# EAGLE design monkeybot (EAGLE 5.12)
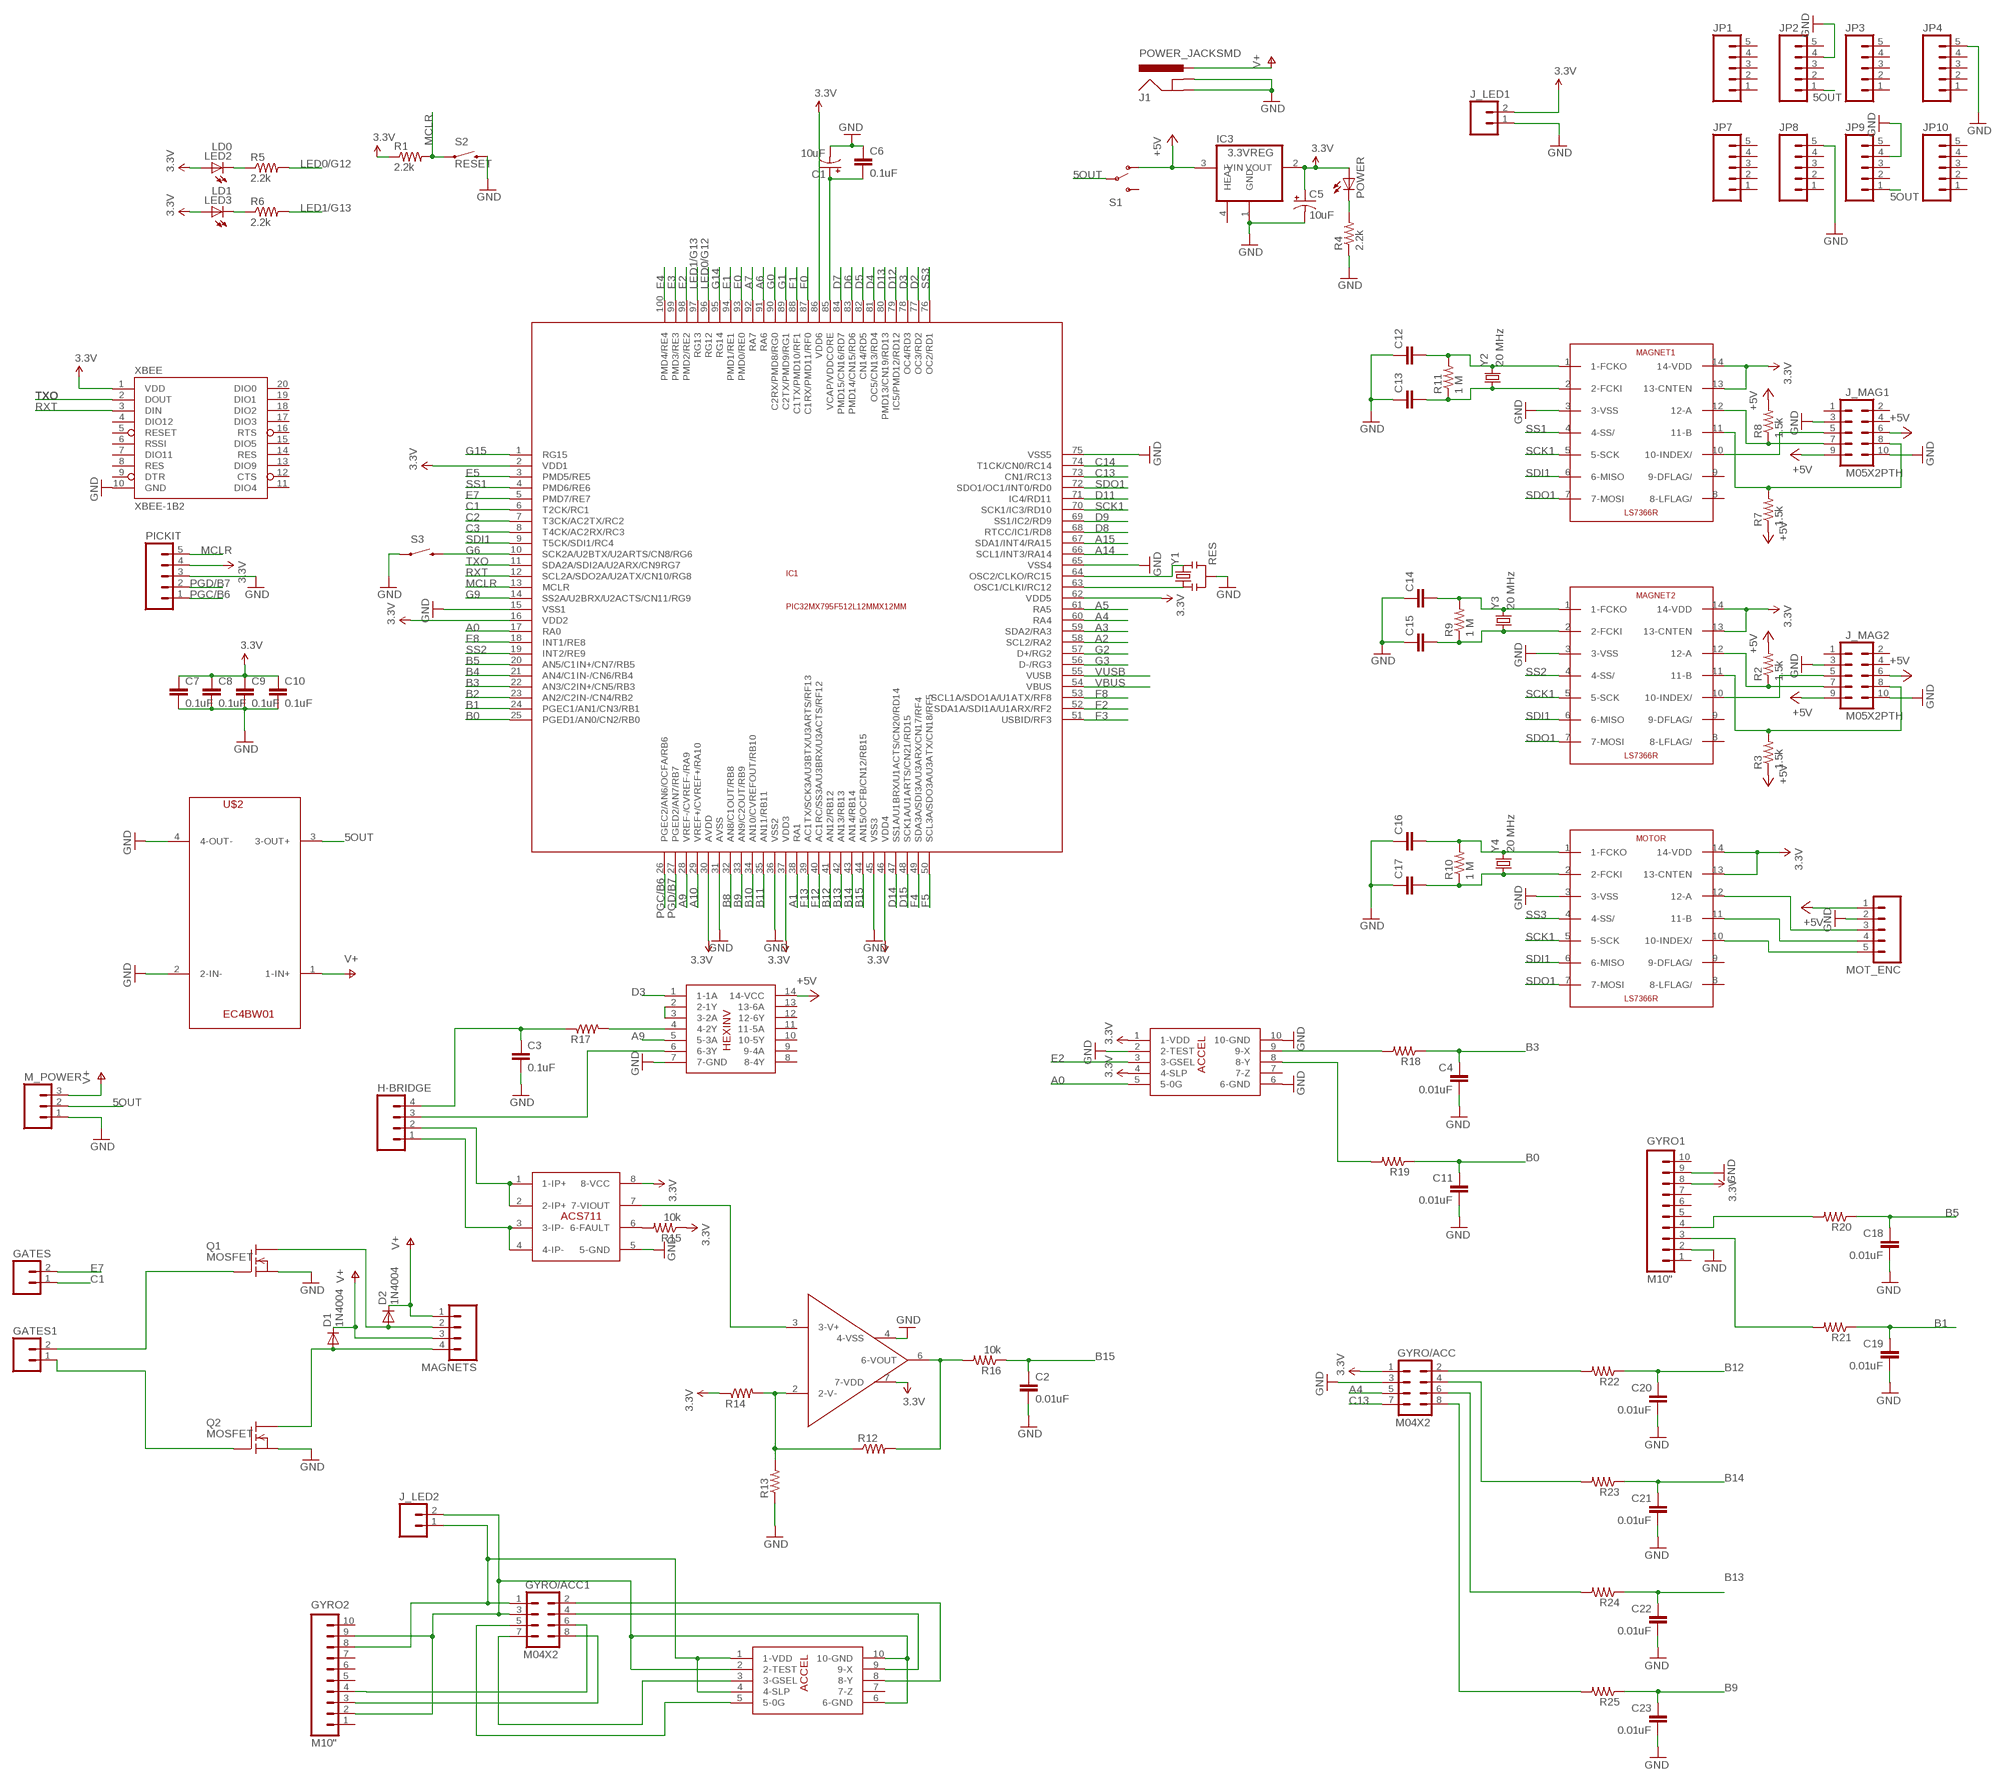
[diagram p0: schematic, sheet 1]

## Parts
C1  10uF  CAP_POL0603-POL  [0603-CAP-POL]
C2  0.01uF  CAP0603-CAP  [0603-CAP]
C3  0.1uF  CAP0603-CAP  [0603-CAP]
C4  0.01uF  CAP0603-CAP  [0603-CAP]
C5  10uF  CAP_POL0603-POL  [0603-CAP-POL]
C6  0.1uF  CAP0603-CAP  [0603-CAP]
C7  0.1uF  CAP0603-CAP  [0603-CAP]
C8  0.1uF  CAP0603-CAP  [0603-CAP]
C9  0.1uF  CAP0603-CAP  [0603-CAP]
C10  0.1uF  CAP0603-CAP  [0603-CAP]
C11  0.01uF  CAP0603-CAP  [0603-CAP]
C12  CAP0603-CAP  [0603-CAP]
C13  CAP0603-CAP  [0603-CAP]
C14  CAP0603-CAP  [0603-CAP]
C15  CAP0603-CAP  [0603-CAP]
C16  CAP0603-CAP  [0603-CAP]
C17  CAP0603-CAP  [0603-CAP]
C18  0.01uF  CAP0603-CAP  [0603-CAP]
C19  0.01uF  CAP0603-CAP  [0603-CAP]
C20  0.01uF  CAP0603-CAP  [0603-CAP]
C21  0.01uF  CAP0603-CAP  [0603-CAP]
C22  0.01uF  CAP0603-CAP  [0603-CAP]
C23  0.01uF  CAP0603-CAP  [0603-CAP]
D1  1N4004  [DO41-10]
D2  1N4004  [DO41-10]
GATES  M02PTH  [1X02]
GATES1  M02PTH  [1X02]
GYRO1  M10"  [1X10]
GYRO2  M10"  [1X10]
GYRO/ACC  M04X2  [2X4]
GYRO/ACC1  M04X2  [2X4]
H-BRIDGE  M04PTH  [1X04]
IC1  PIC32MX795F512L12MMX12MM  [TQFP-100-12X12MM]
IC3  3.3VREG  REG1117  [SOT223]
J1  POWER_JACKSMD  [POWER_JACK_SMD]
J_LED1  M02PTH  [1X02]
J_LED2  M02PTH  [1X02]
J_MAG1  M05X2PTH  [AVR_ICSP]
J_MAG2  M05X2PTH  [AVR_ICSP]
JP1  M05PTH  [1X05]
JP2  M05PTH  [1X05]
JP3  M05PTH  [1X05]
JP4  M05PTH  [1X05]
JP7  M05PTH  [1X05]
JP8  M05PTH  [1X05]
JP9  M05PTH  [1X05]
JP10  M05PTH  [1X05]
LED2  LD0  LED0603  [LED-0603]
LED3  LD1  LED0603  [LED-0603]
M_POWER  M03PTH  [1X03]
MAGNET1  LS7366R  [SO14]
MAGNET2  LS7366R  [SO14]
MAGNETS  M04PTH  [1X04]
MOT_ENC  M05PTH  [1X05]
MOTOR  LS7366R  [SO14]
PICKIT  M05PTH  [1X05]
POWER  LED0603  [LED-0603]
Q1  MOSFET  [DPACK]
Q2  MOSFET  [DPACK]
R1  2.2k  R-US_R0603  [R0603]
R2  1.5k  R-US_R0603  [R0603]
R3  1.5k  R-US_R0603  [R0603]
R4  2.2k  R-US_R0603  [R0603]
R5  2.2k  R-US_R0603  [R0603]
R6  2.2k  R-US_R0603  [R0603]
R7  1.5k  R-US_R0603  [R0603]
R8  1.5k  R-US_R0603  [R0603]
R9  1 M  R-US_R0603  [R0603]
R10  1 M  R-US_R0603  [R0603]
R11  1 M  R-US_R0603  [R0603]
R12  R-US_0204/7  [0204/7]
R13  R-US_0204/7  [0204/7]
R14  R-US_0204/7  [0204/7]
R15  10k  R-US_R0603  [R0603]
R16  10k  R-US_R0603  [R0603]
R17  R-US_0204/7  [0204/7]
R18  R-US_0204/7  [0204/7]
R19  R-US_0204/7  [0204/7]
R20  R-US_0204/7  [0204/7]
R21  R-US_0204/7  [0204/7]
R22  R-US_0204/7  [0204/7]
R23  R-US_0204/7  [0204/7]
R24  R-US_0204/7  [0204/7]
R25  R-US_0204/7  [0204/7]
S1  SWITCH-SPSTSMD  [AYZ0202]
S2  RESET  SWITCH-MOMENTARY-2-SMD-1101NE  [TACTILE-SWITCH-1101NE]
S3  SWITCH-MOMENTARY-2-SMD-1101NE  [TACTILE-SWITCH-1101NE]
U$1  ACCEL  [ACCEL]
U$2  EC4BW01  [EC4BW01]
U$3  74HC04  [74HC04]
U$6  ACS711  [ACS711]
U$7  MCP616  [MCP616]
U$8  ACCEL  [ACCEL]
XBEE  XBEE-1B2  [XBEE-SILK]
Y1  RES  RESONATORSMD  [RESONATOR-SMD]
Y2  20 MHz  CRYSTALHC49US  [HC49US]
Y3  20 MHz  CRYSTALHC49US  [HC49US]
Y4  20 MHz  CRYSTALHC49US  [HC49US]

## Nets
3.3V: C5.1(+) C7.1 C8.1 C9.1 C10.1 GYRO1.8 GYRO/ACC.1 IC1.2(VDD1) IC1.16(VDD2) IC1.30(AVDD) IC1.37(VDD3) IC1.46(VDD4) IC1.62(VDD5) IC1.86(VDD6) IC3.2(VOUT) J_LED1.2 LED2.A LED3.A MAGNET1.13(13-CNTEN) MAGNET1.14(14-VDD) MAGNET2.13(13-CNTEN) MAGNET2.14(14-VDD) MOTOR.13(13-CNTEN) MOTOR.14(14-VDD) PICKIT.4 POWER.A R1.1 R14.1 R15.1 U$6.8(8-VCC) U$7.7(7-VDD) U$8.1(1-VDD) U$8.4(4-SLP) XBEE.1(VDD)
5OUT: JP2.1 JP9.1 M_POWER.2 S1.2(P) U$2.3(3-OUT+)
+5V: IC3.3(VIN) J_MAG1.6 J_MAG1.9 J_MAG2.6 J_MAG2.9 MOT_ENC.1 R2.2 R3.1 R7.1 R8.2 S1.1(O) U$3.14(14-VCC)
A0: IC1.17(RA0) U$8.5(5-0G)
A1: IC1.38(RA1)
A2: IC1.58(SCL2/RA2)
A3: IC1.59(SDA2/RA3)
A4: GYRO/ACC.5 IC1.60(RA4)
A5: IC1.61(RA5)
A6: IC1.91(RA6)
A7: IC1.92(RA7)
A9: IC1.28(VREF-/CVREF-/RA9) U$3.5(5-3A)
A10: IC1.29(VREF+/CVREF+/RA10)
A14: IC1.66(SCL1/INT3/RA14)
A15: IC1.67(SDA1/INT4/RA15)
B0: C11.1 IC1.25(PGED1/AN0/CN2/RB0) R19.1
B1: C19.1 IC1.24(PGEC1/AN1/CN3/RB1) R21.1
B2: IC1.23(AN2/C2IN-/CN4/RB2)
B3: C4.1 IC1.22(AN3/C2IN+/CN5/RB3) R18.1
B4: IC1.21(AN4/C1IN-/CN6/RB4)
B5: C18.1 IC1.20(AN5/C1IN+/CN7/RB5) R20.1
B8: IC1.32(AN8/C1OUT/RB8)
B9: C23.1 IC1.33(AN9/C2OUT/RB9) R25.1
B10: IC1.34(AN10/CVREFOUT/RB10)
B11: IC1.35(AN11/RB11)
B12: C20.1 IC1.41(AN12/RB12) R22.1
B13: C22.1 IC1.42(AN13/RB13) R24.1
B14: C21.1 IC1.43(AN14/RB14) R23.1
B15: C2.1 IC1.44(AN15/OCFB/CN12/RB15) R16.1
C1: GATES.1 IC1.6(T2CK/RC1)
C2: IC1.7(T3CK/AC2TX/RC2)
C3: IC1.8(T4CK/AC2RX/RC3)
C12: IC1.63(OSC1/CLKI/RC12) Y1.1
C13: GYRO/ACC.7 IC1.73(CN1/RC13)
C14: IC1.74(T1CK/CN0/RC14)
C15: IC1.64(OSC2/CLKO/RC15) Y1.3
D2: IC1.77(OC3/RD2)
D3: IC1.78(OC4/RD3) U$3.1(1-1A)
D4: IC1.81(OC5/CN13/RD4)
D5: IC1.82(CN14/RD5)
D6: IC1.83(PMD14/CN15/RD6)
D7: IC1.84(PMD15/CN16/RD7)
D8: IC1.68(RTCC/IC1/RD8)
D9: IC1.69(SS1/IC2/RD9)
D11: IC1.71(IC4/RD11)
D12: IC1.79(IC5/PMD12/RD12)
D13: IC1.80(PMD13/CN19/RD13)
D14: IC1.47(SS1A/U1BRX/U1ACTS/CN20/RD14)
D15: IC1.48(SCK1A/U1ARTS/CN21/RD15)
E0: IC1.93(PMD0/RE0)
E1: IC1.94(PMD1/RE1)
E2: IC1.98(PMD2/RE2) U$8.3(3-GSEL)
E3: IC1.99(PMD3/RE3)
E4: IC1.100(PMD4/RE4)
E5: IC1.3(PMD5/RE5)
E7: GATES.2 IC1.5(PMD7/RE7)
E8: IC1.18(INT1/RE8)
F0: IC1.87(C1RX/PMD11/RF0)
F1: IC1.88(C1TX/PMD10/RF1)
F2: IC1.52(SDA1A/SDI1A/U1ARX/RF2)
F3: IC1.51(USBID/RF3)
F4: IC1.49(SDA3A/SDI3A/U3ARX/CN17/RF4)
F5: IC1.50(SCL3A/SDO3A/U3ATX/CN18/RF5)
F8: IC1.53(SCL1A/SDO1A/U1ATX/RF8)
F12: IC1.40(AC1RC/SS3A/U3BRX/U3ACTS/RF12)
F13: IC1.39(AC1TX/SCK3A/U3BTX/U3ARTS/RF13)
G0: IC1.90(C2RX/PMD8/RG0)
G1: IC1.89(C2TX/PMD9/RG1)
G2: IC1.57(D+/RG2)
G3: IC1.56(D-/RG3)
G6: IC1.10(SCK2A/U2BTX/U2ARTS/CN8/RG6) S3.P$2
G9: IC1.14(SS2A/U2BRX/U2ACTS/CN11/RG9)
G14: IC1.95(RG14)
G15: IC1.1(RG15)
GND: C1.2(-) C2.2 C3.2 C4.2 C5.2(-) C6.1 C7.2 C8.2 C9.2 C10.2 C11.2 C12.1 C13.1 C14.1 C15.1 C16.1 C17.1 C18.2 C19.2 C20.2 C21.2 C22.2 C23.2 GYRO1.2 GYRO1.9 GYRO/ACC.3 IC1.15(VSS1) IC1.31(AVSS) IC1.36(VSS2) IC1.45(VSS3) IC1.65(VSS4) IC1.75(VSS5) IC3.1(GND) J1.GND(GNDBREAK) J1.P$4(GND) J_LED1.1 J_MAG1.3 J_MAG1.10 J_MAG2.3 J_MAG2.10 JP2.4 JP4.5 JP8.5 JP9.4 M_POWER.1 MAGNET1.3(3-VSS) MAGNET2.3(3-VSS) MOT_ENC.2 MOTOR.3(3-VSS) PICKIT.3 Q1.3(S) Q2.3(S) R4.1 R13.1 S2.P$2 S3.P$1 U$2.2(2-IN-) U$2.4(4-OUT-) U$3.7(7-GND) U$6.5(5-GND) U$7.4(4-VSS) U$8.2(2-TEST) U$8.6(6-GND) U$8.10(10-GND) XBEE.10(GND) Y1.2
LED0/G12: IC1.96(RG12) R5.2
LED1/G13: IC1.97(RG13) R6.2
MCLR: IC1.13(MCLR) PICKIT.5 R1.2 S2.P$1
N$2: C12.2 MAGNET1.1(1-FCKO) R11.2 Y2.2
N$3: C1.1(+) C6.2 IC1.85(VCAP/VDDCORE)
N$4: POWER.C R4.2
N$5: LED2.C R5.1
N$6: J_MAG2.7 MAGNET2.12(12-A) R2.1
N$7: LED3.C R6.1
N$8: J_MAG1.7 MAGNET1.12(12-A) R8.1
N$9: GYRO1.4 R20.2
N$10: J_MAG2.8 MAGNET2.11(11-B) R3.2
N$11: J_MAG1.8 MAGNET1.11(11-B) R7.2
N$12: J_MAG1.5 MAGNET1.10(10-INDEX/)
N$13: J_MAG2.5 MAGNET2.10(10-INDEX/)
N$14: GYRO/ACC.2 R22.2
N$15: C13.2 MAGNET1.2(2-FCKI) R11.1 Y2.1
N$16: C14.2 MAGNET2.1(1-FCKO) R9.2 Y3.2
N$17: C15.2 MAGNET2.2(2-FCKI) R9.1 Y3.1
N$18: C16.2 MOTOR.1(1-FCKO) R10.2 Y4.2
N$19: C17.2 MOTOR.2(2-FCKI) R10.1 Y4.1
N$20: MOT_ENC.3 MOTOR.12(12-A)
N$21: MOT_ENC.4 MOTOR.11(11-B)
N$22: MOT_ENC.5 MOTOR.10(10-INDEX/)
N$23: R15.2 U$6.6(6-FAULT)
N$24: U$6.7(7-VIOUT) U$7.3(3-V+)
N$25: R12.1 R13.2 R14.2 U$7.2(2-V-)
N$26: R12.2 R16.2 U$7.6(6-VOUT)
N$27: U$3.2(2-1Y) U$3.3(3-2A)
N$28: R17.2 U$3.4(4-2Y)
N$29: H-BRIDGE.2 U$6.1(1-IP+) U$6.2(2-IP+)
N$30: H-BRIDGE.1 U$6.3(3-IP-) U$6.4(4-IP-)
N$31: H-BRIDGE.3 U$3.6(6-3Y)
N$32: GATES1.2 Q1.1(G)
N$33: GATES1.1 Q2.1(G)
N$34: GYRO1.3 R21.2
N$35: R19.2 U$8.8(8-Y)
N$36: R18.2 U$8.9(9-X)
N$38: GYRO/ACC.4 R23.2
N$43: GYRO/ACC.6 R24.2
N$44: GYRO/ACC.8 R25.2
N$45: D2.A MAGNETS.2 Q1.4(D)
N$46: D1.A MAGNETS.4 Q2.4(D)
N$47: GYRO2.8 GYRO/ACC1.1 J_LED2.1 U$1.1(1-VDD) U$1.4(4-SLP)
N$48: GYRO2.2 GYRO2.9 GYRO/ACC1.3 J_LED2.2 U$1.2(2-TEST) U$1.6(6-GND) U$1.10(10-GND)
N$49: GYRO2.3 GYRO/ACC1.8
N$50: GYRO2.4 GYRO/ACC1.6
N$51: GYRO/ACC1.7 U$1.3(3-GSEL)
N$52: GYRO/ACC1.4 U$1.9(9-X)
N$53: GYRO/ACC1.5 U$1.5(5-0G)
N$54: GYRO/ACC1.2 U$1.8(8-Y)
N$115: C3.1 H-BRIDGE.4 R17.1
PGC/B6: IC1.26(PGEC2/AN6/OCFA/RB6) PICKIT.1
PGD/B7: IC1.27(PGED2/AN7/RB7) PICKIT.2
RXT: IC1.12(SCL2A/SDO2A/U2ATX/CN10/RG8) XBEE.3(DIN)
SCK1: IC1.70(SCK1/IC3/RD10) MAGNET1.5(5-SCK) MAGNET2.5(5-SCK) MOTOR.5(5-SCK)
SDI1: IC1.9(T5CK/SDI1/RC4) MAGNET1.6(6-MISO) MAGNET2.6(6-MISO) MOTOR.6(6-MISO)
SDO1: IC1.72(SDO1/OC1/INT0/RD0) MAGNET1.7(7-MOSI) MAGNET2.7(7-MOSI) MOTOR.7(7-MOSI)
SS1: IC1.4(PMD6/RE6) MAGNET1.4(4-SS/)
SS2: IC1.19(INT2/RE9) MAGNET2.4(4-SS/)
SS3: IC1.76(OC2/RD1) MOTOR.4(4-SS/)
TXO: IC1.11(SDA2A/SDI2A/U2ARX/CN9RG7) XBEE.2(DOUT)
V+: D1.C D2.C J1.VIN0(PWR) M_POWER.3 MAGNETS.1 MAGNETS.3 U$2.1(1-IN+)
VBUS: IC1.54(VBUS)
VUSB: IC1.55(VUSB)
Unconnected: GYRO1.1 GYRO1.5 GYRO1.6 GYRO1.7 GYRO1.10 GYRO2.1 GYRO2.5 GYRO2.6 GYRO2.7 GYRO2.10 IC3.4(HEAT) J_MAG1.1 J_MAG1.2 J_MAG1.4 J_MAG2.1 J_MAG2.2 J_MAG2.4 JP1.1 JP1.2 JP1.3 JP1.4 JP1.5 JP2.2 JP2.3 JP2.5 JP3.1 JP3.2 JP3.3 JP3.4 JP3.5 JP4.1 JP4.2 JP4.3 JP4.4 JP7.1 JP7.2 JP7.3 JP7.4 JP7.5 JP8.1 JP8.2 JP8.3 JP8.4 JP9.2 JP9.3 JP9.5 JP10.1 JP10.2 JP10.3 JP10.4 JP10.5 MAGNET1.8(8-LFLAG/) MAGNET1.9(9-DFLAG/) MAGNET2.8(8-LFLAG/) MAGNET2.9(9-DFLAG/) MOTOR.8(8-LFLAG/) MOTOR.9(9-DFLAG/) S1.3(S) U$1.7(7-Z) U$3.8(8-4Y) U$3.9(9-4A) U$3.10(10-5Y) U$3.11(11-5A) U$3.12(12-6Y) U$3.13(13-6A) U$8.7(7-Z) XBEE.4(DIO12) XBEE.5(RESET) XBEE.6(RSSI) XBEE.7(DIO11) XBEE.8(RES) XBEE.9(DTR) XBEE.11(DIO4) XBEE.12(CTS) XBEE.13(DIO9) XBEE.14(RES) XBEE.15(DIO5) XBEE.16(RTS) XBEE.17(DIO3) XBEE.18(DIO2) XBEE.19(DIO1) XBEE.20(DIO0)

## Library data of the parts
C1 C5 = nick_nu32_pic32mx795_v1:CAP_POL: Capacitor Polarized These are standard SMD and PTH capacitors. Normally 10uF, 47uF, and 100uF in electrolytic and tantalum varieties. Always verify the external diameter of the through hole cap, it varies with capacity, voltage, and manufacturer. The EIA devices should be standard.
C2-C4 C6-C23 = nick_nu32_pic32mx795_v1:CAP: Capacitor Standard 0603 ceramic capacitor, and 0.1" leaded capacitor.
D1 D2 = diode:1N4004: DIODE general purpose rectifier, 1 A
GATES GATES1 J_LED1 J_LED2 = SparkFun:M02: Header 2 Standard 2-pin 0.1" header. Use with straight break away headers (SKU : PRT-00116), right angle break away headers (PRT-00553), swiss pins (PRT-00743), machine pins (PRT-00117), and female headers (PRT-00115). Molex polarized connector foot print use with SKU : PRT-08233 with associated crimp pins and housings.
GYRO1 GYRO2 = SparkFun:M10: Header 10 Standard 10-pin 0.1" header. Use with straight break away headers (SKU : PRT-00116), right angle break away headers (PRT-00553), swiss pins (PRT-00743), machine pins (PRT-00117), and female headers (PRT-00115).
GYRO/ACC GYRO/ACC1 = SparkFun:M04X2
H-BRIDGE MAGNETS = SparkFun:M04: Header 4 Standard 4-pin 0.1" header. Use with straight break away headers (SKU : PRT-00116), right angle break away headers (PRT-00553), swiss pins (PRT-00743), machine pins (PRT-00117), and female headers (PRT-00115). Molex polarized connector foot print use with SKU : PRT-08231 with associated crimp pins and housings. 1MM SMD Version SKU: PRT-10208
IC1 = nick_nu32_pic32mx795_v1:PIC32MX795F512L
IC3 = nick_nu32_pic32mx795_v1:REG1117: 800mA and 1A Low Dropout (LDO) Positive Regulator 1.8V, 2.5V, 2.85V, 3.3V, 5V, and Adj
J1 = nick_nu32_pic32mx795_v1:POWER_JACK: Power Jack This is the standard 5.5mm barrel jack for power. The PTH is the most common, proven, reliable, footprint. All others are experimental. The Slot footprint only works if the mill layer is transmitted to the PCB fab house so be warned. Spark Fun Electronics SKU : PRT-00119. Mating wall wart : TOL-00298 (and others)
J_MAG1 J_MAG2 = andy-monkeybot:M05X2: Header 5x2 Standard 10-pin dual row 0.1" header. Commonly used with AVR-ISP. Use with Spark Fun Electronics SKU: PRT-00778
JP1-JP4 JP7-JP10 PICKIT = monkeybot:M05: Header 5 Standard 5-pin 0.1" header. Use with straight break away headers (SKU : PRT-00116), right angle break away headers (PRT-00553), swiss pins (PRT-00743), machine pins (PRT-00117), and female headers (PRT-00115). Molex polarized connector foot print use with SKU : PRT-08230 with associated crimp pins and housings.
LED2 LED3 POWER = nick_nu32_pic32mx795_v1:LED: LEDs Standard schematic elements and footprints for 5mm, 3mm, 1206, and 0603 sized LEDs. 5mm - Spark Fun Electronics SKU : COM-00529 (and others)
M_POWER = SparkFun:M03: Header 3 Standard 3-pin 0.1" header. Use with straight break away headers (SKU : PRT-00116), right angle break away headers (PRT-00553), swiss pins (PRT-00743), machine pins (PRT-00117), and female headers (PRT-00115). Molex polarized connector foot print use with SKU : PRT-08232 with associated crimp pins and housings.
MAGNET1 MAGNET2 MOTOR = andy-monkeybot:LS7366R
MOT_ENC = andy-monkeybot:M05: Header 5 Standard 5-pin 0.1" header. Use with straight break away headers (SKU : PRT-00116), right angle break away headers (PRT-00553), swiss pins (PRT-00743), machine pins (PRT-00117), and female headers (PRT-00115). Molex polarized connector foot print use with SKU : PRT-08230 with associated crimp pins and housings.
Q1 Q2 = monkeybot:MOSFET: N-Channel Enhancement MOSFET 200V; 1.5A; 1,6Ohm
R1 R4-R6 R15 R16 = nick_nu32_pic32mx795_v1:R-US_: RESISTOR, American symbol
R2 R3 R7 R8 = andy-monkeybot:R-US_: RESISTOR, American symbol
R9-R14 R17-R25 = monkeybot:R-US_: RESISTOR, American symbol
S1 = nick_nu32_pic32mx795_v1:SWITCH-SPST: SPST Switch Simple slide switch. Spark Fun Electronics SKU : COM-00102
S2 S3 = nick_nu32_pic32mx795_v1:SWITCH-MOMENTARY-2
U$1 U$8 = monkeybot:ACCEL
U$2 = monkeybot:EC4BW01
U$3 = monkeybot:74HC04
U$6 = monkeybot:ACS711
U$7 = monkeybot:MCP616
XBEE = SparkFun:XBEE-1
Y1 = nick_nu32_pic32mx795_v1:RESONATOR: Resonator Small SMD resonator. This is the itty bitty 10/20MHz resonators with built in caps. CSTCE10M0G55 and CSTCE20M0V53. Footprint has been reviewed closely but hasn't been tested yet.
Y2-Y4 = andy-monkeybot:CRYSTAL: Crystals Various standard crystals. Proven footprints. Spark Fun Electronics SKU : COM-00534

## Board
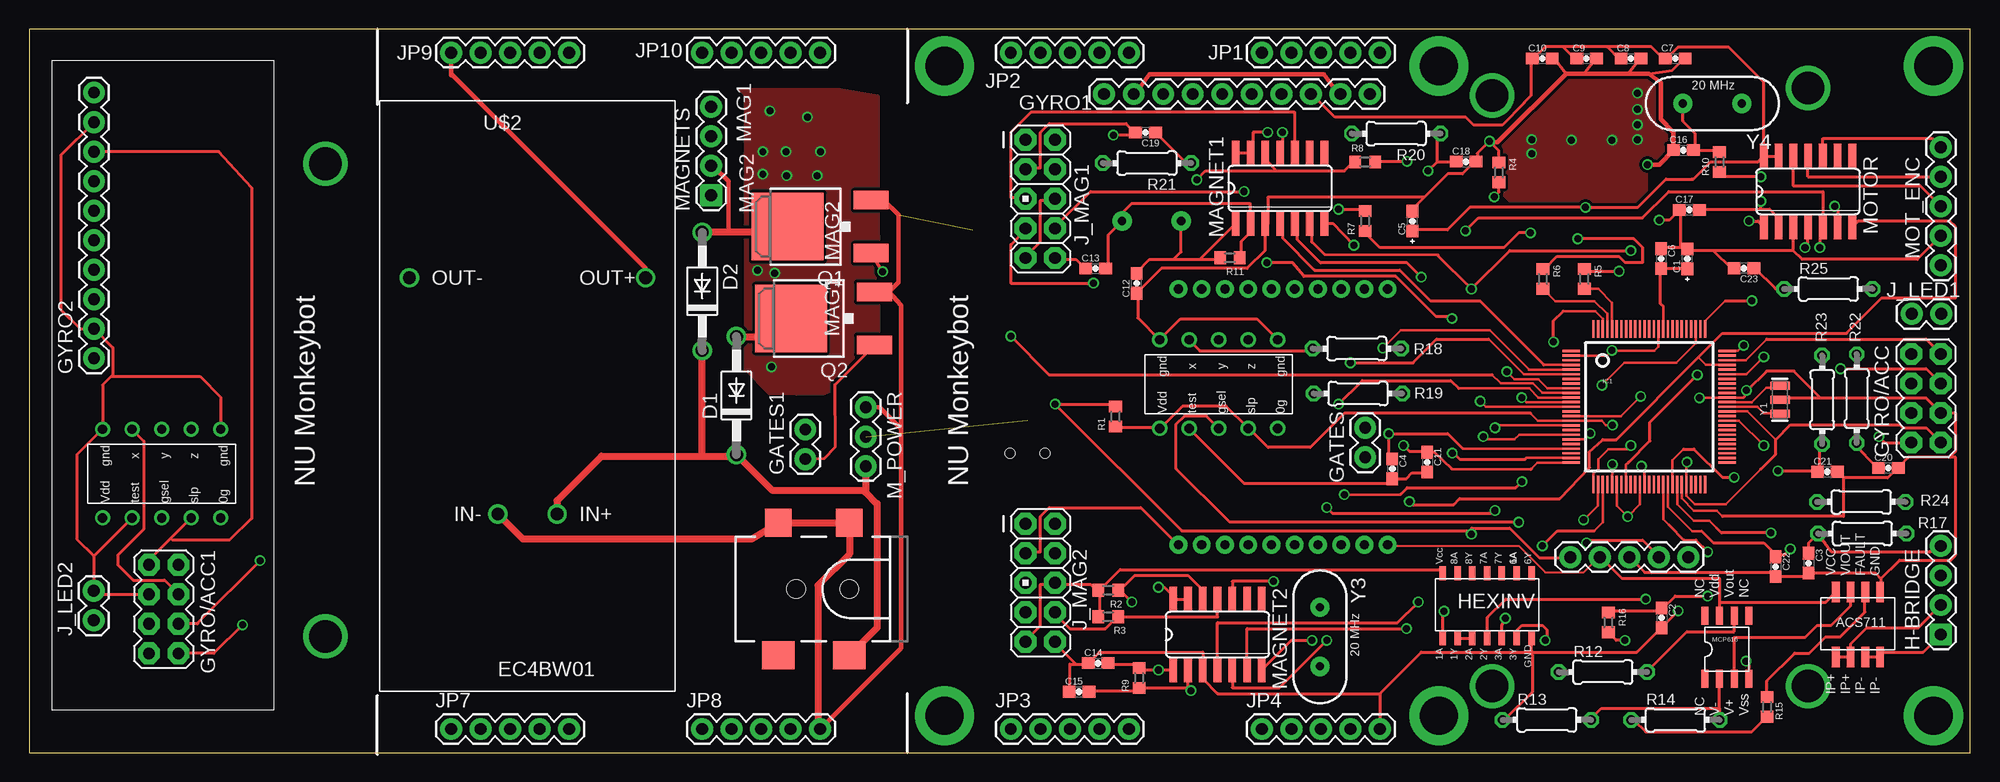
[diagram p1: board, top side]
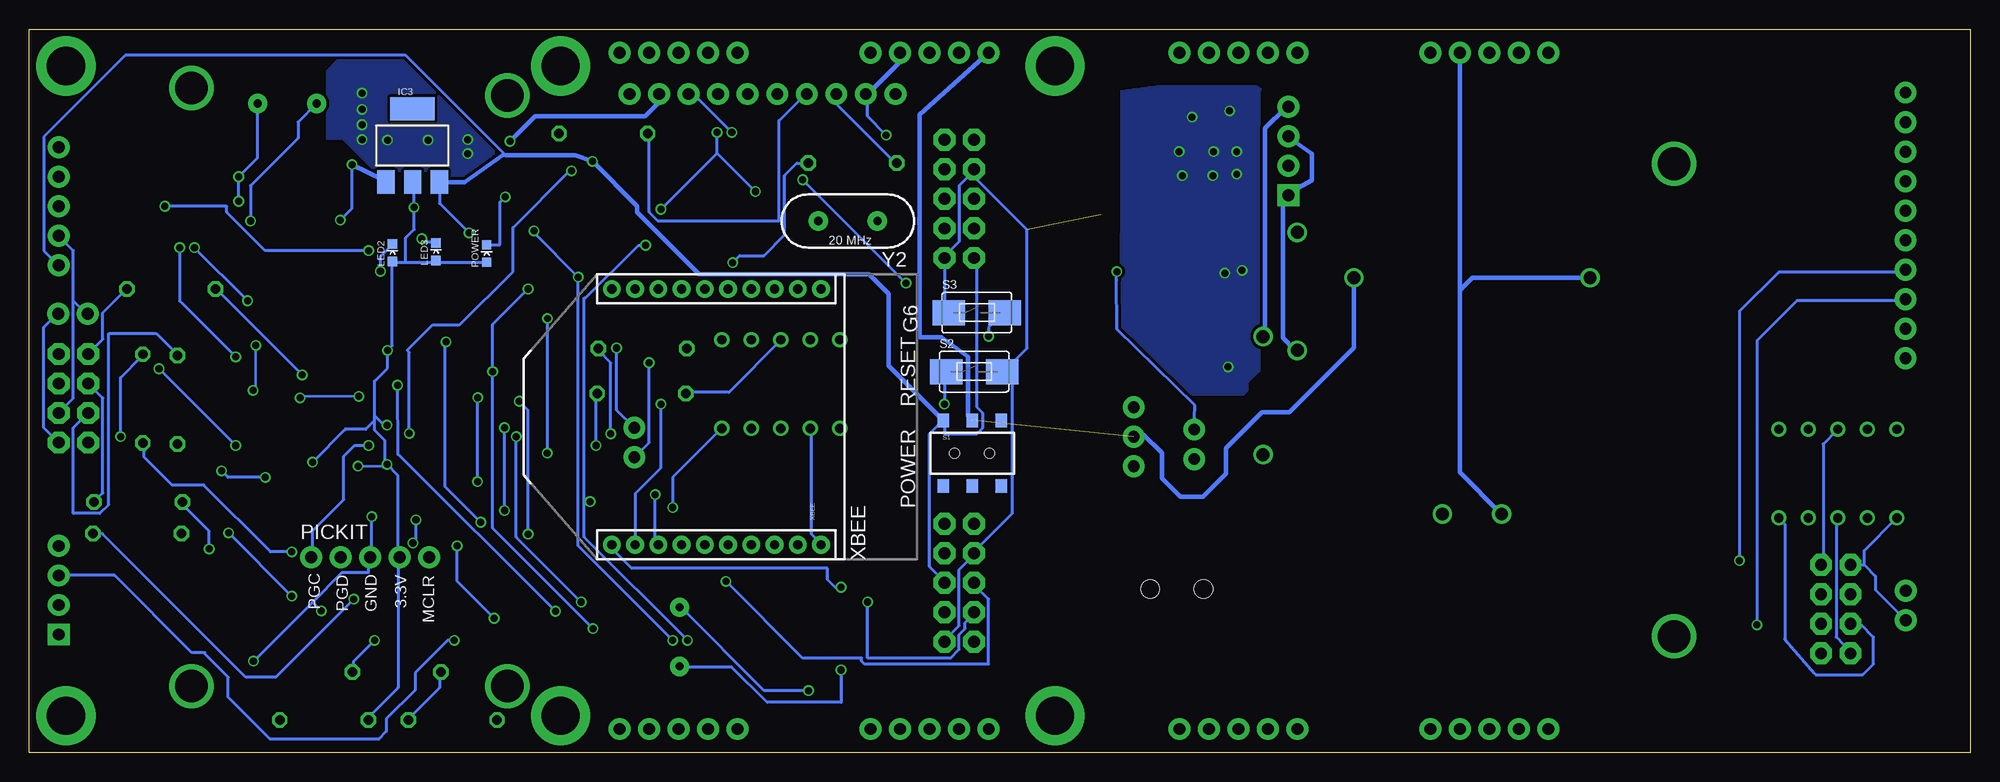
[diagram p2: board, bottom side, seen from below]

Size 167 x 62.23 mm. Coordinates in mm from the lower left corner, seen from the top.
Outline: 167,0 167,62.23 0,62.23 0,0 167,0
Copper layers (1*16): Top 0.035mm / dielectric 1.5mm / Bottom 0.035mm
Design rules "Fusion_eagle_rule_v1.1": minimum track width 6mil, minimum drill 12mil, track to track 6mil, track to pad 6mil, pad to pad 6mil, via to via 6mil, smd to smd 0mil, copper to edge 10mil, drill to drill 10mil, minimum pad ring 10mil, minimum via ring 6mil, stop-mask expansion 2mil, vias tented up to drill 100mil, thermal gap 10mil

### Footprints (pad centres in the part's own frame; a part is rotated, then mirrored left to right if it is on the bottom)
0603-CAP-POL = smd 1.1 x 1: 1 -0.85,0; 2 0.85,0
0603-CAP = smd 1.1 x 1: 1 -0.85,0; 2 0.85,0
DO41-10 = drill 1.118 round: A 5.08,0; C -5.08,0
1X02 = drill 1.016 pad 1.88 round: 1 0,0; 2 2.54,0
1X10 = drill 1.016 pad 1.88 round: 1 0,0; 2 2.54,0; 3 5.08,0; 4 7.62,0; 5 10.16,0; 6 12.7,0; 7 15.24,0; 8 17.78,0; 9 20.32,0; 10 22.86,0
2X4 = drill 1.016 pad 1.88 octagon: 1 -3.81,-1.27; 2 -3.81,1.27; 3 -1.27,-1.27; 4 -1.27,1.27; 5 1.27,-1.27; 6 1.27,1.27; 7 3.81,-1.27; 8 3.81,1.27
1X04 = drill 1.016 pad 1.88 square: 1 0,0 | drill 1.016 pad 1.88 round: 2 2.54,0; 3 5.08,0; 4 7.62,0
TQFP-100-12X12MM = smd 1.5 x 0.2: 1 -6.7,4.8; 2 -6.7,4.4; 3 -6.7,4; 4 -6.7,3.6; 5 -6.7,3.2; 6 -6.7,2.8; 7 -6.7,2.4; 8 -6.7,2; 9 -6.7,1.6; 10 -6.7,1.2; 11 -6.7,0.8; 12 -6.7,0.4; 13 -6.7,0; 14 -6.7,-0.4; 15 -6.7,-0.8; 16 -6.7,-1.2; 17 -6.7,-1.6; 18 -6.7,-2; 19 -6.7,-2.4; 20 -6.7,-2.8; 21 -6.7,-3.2; 22 -6.7,-3.6; 23 -6.7,-4; 24 -6.7,-4.4; 25 -6.7,-4.8; 51 6.7,-4.8; 52 6.7,-4.4; 53 6.7,-4; 54 6.7,-3.6; 55 6.7,-3.2; 56 6.7,-2.8; 57 6.7,-2.4; 58 6.7,-2; 59 6.7,-1.6; 60 6.7,-1.2; 61 6.7,-0.8; 62 6.7,-0.4; 63 6.7,0; 64 6.7,0.4; 65 6.7,0.8; 66 6.7,1.2; 67 6.7,1.6; 68 6.7,2; 69 6.7,2.4; 70 6.7,2.8; 71 6.7,3.2; 72 6.7,3.6; 73 6.7,4; 74 6.7,4.4; 75 6.7,4.8 | smd 0.2 x 1.5: 26 -4.8,-6.7; 27 -4.4,-6.7; 28 -4,-6.7; 29 -3.6,-6.7; 30 -3.2,-6.7; 31 -2.8,-6.7; 32 -2.4,-6.7; 33 -2,-6.7; 34 -1.6,-6.7; 35 -1.2,-6.7; 36 -0.8,-6.7; 37 -0.4,-6.7; 38 0,-6.7; 39 0.4,-6.7; 40 0.8,-6.7; 41 1.2,-6.7; 42 1.6,-6.7; 43 2,-6.7; 44 2.4,-6.7; 45 2.8,-6.7; 46 3.2,-6.7; 47 3.6,-6.7; 48 4,-6.7; 49 4.4,-6.7; 50 4.8,-6.7; 76 4.8,6.7; 77 4.4,6.7; 78 4,6.7; 79 3.6,6.7; 80 3.2,6.7; 81 2.8,6.7; 82 2.4,6.7; 83 2,6.7; 84 1.6,6.7; 85 1.2,6.7; 86 0.8,6.7; 87 0.4,6.7; 88 0,6.7; 89 -0.4,6.7; 90 -0.8,6.7; 91 -1.2,6.7; 92 -1.6,6.7; 93 -2,6.7; 94 -2.4,6.7; 95 -2.8,6.7; 96 -3.2,6.7; 97 -3.6,6.7; 98 -4,6.7; 99 -4.4,6.7; 100 -4.8,6.7
SOT223 = smd 1.499 x 2.007: 1 -2.261,-3.15; 2 0.025,-3.15; 3 2.311,-3.15 | smd 3.81 x 2.007: 4 0,3.15
POWER_JACK_SMD = smd 2.286 x 2.4: GND 0,-5.7; P$4 6.1,-5.7 | smd 2.8 x 2.4: VIN0 0,5.7; VIN1 6.1,5.7 | hole 1.6: 0,0; 4.572,0
AVR_ICSP = drill 1.016 pad 1.88 octagon: 1 -1.27,5.08; 2 1.27,5.08; 3 -1.27,2.54; 4 1.27,2.54; 5 -1.27,0; 6 1.27,0; 7 -1.27,-2.54; 8 1.27,-2.54; 9 -1.27,-5.08; 10 1.27,-5.08
1X05 = drill 1.016 pad 1.88 round: 1 0,0; 2 2.54,0; 3 5.08,0; 4 7.62,0; 5 10.16,0
LED-0603 = smd 0.8 x 0.8: A 0,-0.75; C 0,0.75
1X03 = drill 1.016 pad 1.88 round: 1 0,0; 2 2.54,0; 3 5.08,0
SO14 = smd 0.66 x 2.032: 1 -3.81,-3.073; 2 -2.54,-3.073; 3 -1.27,-3.073; 4 0,-3.073; 5 1.27,-3.073; 6 2.54,-3.073; 7 3.81,-3.073; 8 3.81,3.073; 9 2.54,3.073; 10 1.27,3.073; 11 0,3.073; 12 -1.27,3.073; 13 -2.54,3.073; 14 -3.81,3.073
DPACK = smd 1.6 x 3: 1 -2.28,-4.8; 3 2.28,-4.8 | smd 5.8 x 6.2: 4 0,2.38
R0603 = smd 1 x 1.1: 1 -0.85,0; 2 0.85,0
0204/7 = drill 0.813 octagon: 1 -3.81,0; 2 3.81,0
AYZ0202 = smd 1 x 1.15: 1 -2.5,2.825; 2 0,2.825; 3 2.5,2.825; 4 -2.5,-2.825; 5 0,-2.825; 6 2.5,-2.825 | hole 0.85: 1.5,0; -1.5,0
TACTILE-SWITCH-1101NE = smd 2.794 x 2.159: P$1 -2.413,0; P$2 2.413,0
ACCEL = drill 0.8 round: 1 0,10.16; 2 0,7.62; 3 0,5.08; 4 0,2.54; 5 0,0; 6 7.62,0; 7 7.62,2.54; 8 7.62,5.08; 9 7.62,7.62; 10 7.62,10.16
EC4BW01 = drill 1.1 round: 1 2.54,-10.16; 2 -2.54,-10.16; 3 10.16,10.16; 4 -10.16,10.16
74HC04 = smd 0.559 x 1.194: 1 0,0; 2 1.27,0; 3 2.54,0; 4 3.81,0; 5 5.08,0; 6 6.35,0; 7 7.62,0; 8 7.62,5.588; 9 6.35,5.588; 10 5.08,5.588; 11 3.81,5.588; 12 2.54,5.588; 13 1.27,5.588; 14 0,5.588
ACS711 = smd 0.66 x 1.753: 1 0,0; 2 1.27,0; 3 2.54,0; 4 3.81,0; 5 3.81,5.588; 6 2.54,5.588; 7 1.27,5.588; 8 0,5.588
MCP616 = smd 0.61 x 1.549: 1 0,0; 2 1.27,0; 3 2.54,0; 4 3.81,0; 5 3.81,5.41; 6 2.54,5.41; 7 1.27,5.41; 8 0,5.41
XBEE-SILK = drill 0.8 pad 1.524 round: 1 -11,20; 2 -11,18; 3 -11,16; 4 -11,14; 5 -11,12; 6 -11,10; 7 -11,8; 8 -11,6; 9 -11,4; 10 -11,2; 11 11,2; 12 11,4; 13 11,6; 14 11,8; 15 11,10; 16 11,12; 17 11,14; 18 11,16; 19 11,18; 20 11,20
RESONATOR-SMD = smd 0.7 x 1.7: 1 -1.2,0; 2 0,0; 3 1.2,0
HC49US = drill 0.7 pad 1.651 round: 1 -2.54,0; 2 2.54,0

### Placement (x,y rotation side)
C1  142.65,42.47 90 top
C2  140.44,11.58 270 top
C3  153.09,16.31 270 top
C4  117.27,24.41 270 top
C5  119,45.72 90 top
C6  140.39,42.49 270 top
C7  141.61,59.69 0 top
C8  137.79,59.69 0 top
C9  133.99,59.69 0 top
C10  130.18,59.69 0 top
C11  120.27,24.99 270 top
C12  95.28,40.36 90 top
C13  91.74,41.63 0 top
C14  91.97,7.7 0 top
C15  90.32,5.23 0 top
C16  142.32,51.82 0 top
C17  142.82,46.69 0 top
C18  123.62,50.83 0 top
C19  96.04,53.34 180 top
C20  159.94,24.49 0 top
C21  154.71,24.16 0 top
C22  150.24,16 270 top
C23  147.52,41.66 180 top
D1  60.86,30.71 90 top
D2  57.91,39.67 90 top
GATES  114.94,25.4 90 top
GATES1  66.78,25.25 90 top
GYRO1  92.48,56.64 0 top
GYRO2  5.59,33.91 90 top
GYRO/ACC  163.19,30.48 90 top
GYRO/ACC1  11.58,12.34 270 top
H-BRIDGE  164.47,10.16 90 top
IC1  139.37,29.74 0 top
IC3  134.04,52.22 0 bottom
J1  70.56,14.07 180 top
J_LED1  161.95,37.74 0 top
J_LED2  5.56,11.38 90 top
J_MAG1  87,47.62 0 top
J_MAG2  87,14.61 0 top
JP1  106.05,60.2 0 top
JP2  84.45,60.2 0 top
JP3  84.45,2.03 0 top
JP4  106.05,2.03 0 top
JP7  36.3,2.03 0 top
JP8  57.89,2.03 0 top
JP9  36.3,60.2 0 top
JP10  57.89,60.2 0 top
LED2  135.74,43 0 bottom
LED3  132,43.08 0 bottom
M_POWER  71.98,29.72 270 top
MAGNET1  107.62,48.54 0 top
MAGNET2  102.23,10.16 0 top
MAGNETS  58.67,47.93 90 top
MOT_ENC  164.47,41.91 90 top
MOTOR  153.03,48.26 0 top
PICKIT  142.75,16.81 180 top
POWER  127.63,42.93 0 bottom
Q1  67.64,45.24 90 top
Q2  67.92,37.34 90 top
R1  93.45,28.91 90 top
R2  92.84,13.97 180 top
R3  92.84,11.68 0 top
R4  126.44,49.91 270 top
R5  133.78,40.74 270 top
R6  130.23,40.74 270 top
R7  114.94,45.72 90 top
R8  114.94,50.8 0 top
R9  95.5,6.43 90 top
R10  145.41,50.8 90 top
R11  103.3,42.57 180 top
R12  135.38,6.93 0 top
R13  130.56,2.82 0 top
R14  141.63,2.82 0 top
R15  149.5,3.94 90 top
R16  135.86,11.2 270 top
R17  157.71,18.85 0 top
R18  114.22,34.75 180 top
R19  114.33,30.89 180 top
R20  117.6,53.24 180 top
R21  96.16,50.7 180 top
R22  157.23,30.45 90 top
R23  154.25,30.35 90 top
R24  157.61,21.56 0 top
R25  154.79,39.88 0 top
S1  85.88,25.76 0 bottom
S2  85.7,32.77 0 bottom
S3  85.47,37.85 0 bottom
U$1  16.48,20.19 90 top
U$2  42.88,30.68 0 top
U$3  121.62,9.86 0 top
U$6  155.42,8.23 0 top
U$7  144.14,6.35 0 top
U$8  107.42,27.89 90 top
XBEE  96.88,28.88 90 bottom
Y1  150.62,30.35 90 top
Y2  96.57,45.72 180 bottom
Y3  111.05,9.96 270 top
Y4  144.81,55.83 180 top

### Tracks (layer width: path | path; a pad name or v marks a point on that pad's centre or on a via)
3.3V  (via drill 0.6, 0.61)
  Top 0.152: 93.6,27.94 R1.1 | PICKIT.4 135,16.76 133.73,15.49 130.43,15.49 128.14,17.78 116.97,17.78 XBEE.1
  Top 0.203: 129.16,29.18 129.8,28.54 IC1.16 135.29,28.54 135.66,28.17 v136.22,28.17 | v136.22,24.79 136.22,23.93 136.17,23.88 IC1.30 | IC1.2 135.72,34.14 v136.17,34.59 136.19,34.57 139.83,34.57 140.17,34.91 IC1.86 | IC1.37 138.97,24.38 v138.71,24.64 | IC1.62 147.82,29.34 150.24,26.92 | v142.62,24.99 142.57,24.94 IC1.46 142.57,22.1 143.31,21.36 145.95,21.36 148.97,24.38
  Top 0.254: MAGNET1.14 104.01,51.56 105.03,51.56 MAGNET1.13 105.28,51.82 105.28,53.34 v106.55,53.34 | 131.95,60.71 130.43,60.71 129.41,59.69 C10.1 129.18,59.55 129.18,56.49 128.6,55.91 128.6,55.85 126.72,53.98 124.28,53.98 123.6,54.66 112.34,54.66 110.36,56.64 GYRO1.8 | 131.95,60.71 132.97,59.69 C9.1 | 135.76,60.71 136.78,59.69 C8.1 | 135.76,60.71 131.95,60.71 | 135.76,60.71 139.57,60.71 140.59,59.69 C7.1 140.84,59.69 141.86,60.71 141.88,60.68 146.2,60.68 149.22,57.66 MOTOR.14 149.22,51.31 | 149.22,51.31 148.72,50.8 144.65,50.8 143.13,49.28 143.08,49.33 140.82,49.33 138.38,46.89 v133.88,46.89 123.95,46.89 122.02,44.96 119,44.96 C5.1 | 149.22,51.31 150.5,51.31 MOTOR.13 | MAGNET2.13 99.69,13.21 98.42,13.21 MAGNET2.14 98.42,13.46 97.66,14.22 v97.16,14.22 | 129.16,29.18 129.16,29.21 113.16,29.21 110.21,26.26 106.58,26.26 104.95,27.89 U$8.4 102.97,29.79 99.24,29.79 97.38,27.94 97.21,27.94 | 148.97,24.38 150.24,25.65 150.24,26.92 151.51,28.19 160.91,28.19 161.16,27.94 163.19,27.94 GYRO/ACC.1 | 145.41,12.95 U$7.7 | R14.1 138.05,2.79 139.06,1.78 148.19,1.78 R15.1 | 145.41,12.95 145.41,14.99 137.03,14.99 135.25,16.76 PICKIT.4 | 145.41,12.95 154.56,12.95 U$6.8 | 97.21,27.94 93.6,27.94 | 97.21,27.94 U$8.1
  Top 0.406: R15.1 149.48,3.09
  Bottom 0.203: v138.71,24.64 136.37,24.64 v136.22,24.79
  Bottom 0.254: GYRO/ACC.1 165.74,27.94 165.74,36.58 164.72,37.59 J_LED1.2 | 134.57,42.16 135.51,42.16 LED2.A 135.76,42.16 135.76,35 v136.17,34.59 136.17,33.07 137.29,31.95 137.29,28.98 | 134.57,42.16 132.21,42.16 LED3.A 131.95,42.16 127.63,42.16 POWER.A | IC3.2 134.24,49.02 | R14.1 137.79,3.05 135.25,5.59 135.25,16.76 PICKIT.4 135.25,17.02 135.25,23.82 v136.22,24.79 | IC3.2 133.99,49.28 | v136.22,24.79 136.17,24.84 | v136.22,24.79 136.4,24.97 | v136.22,28.17 136.47,28.17 137.29,28.98 | 137.29,28.57 137.29,28.98 | 137.29,28.57 137.29,27.74 136.37,26.82 136.37,24.94 v136.22,24.79 | 137.29,28.57 138.05,27.81 139.85,27.81 139.85,27.76 v142.62,24.99 | IC3.2 133.88,48.95 v133.88,46.89 133.88,45.03 133.86,45.01 134.59,44.27 134.59,42.19 134.57,42.16 | v106.55,53.34 109.85,56.64 GYRO1.8 | XBEE.1 116.88,17.56 115.16,15.85 98.32,15.85 98.32,14.88 97.66,14.22 v97.16,14.22
5OUT  (1 unrouted)
  Top 0.406: 36.3,58.4 JP9.1 | 36.3,58.4 36.3,58.27 | U$2.3 53.03,41.66 36.3,58.4
  Bottom 0.254: 86.23,28.96 85.98,28.7 S1.2
  Bottom 0.406: 86.23,28.96 86.23,34.04 88.52,35.74 90.42,35.74 90.42,54.86 JP2.1 | U$2.3 53.03,34.82 58.6,29.26 60.96,29.26 64.06,26.16 64.06,24 66.04,22.02 67.97,22.02 69.55,23.6 69.55,25.78 71.12,27.36 71.81,27.36 M_POWER.2
+5V  (via drill 0.61)
  Top 0.254: v129.16,44.7 128.14,44.7 126.87,43.43 116.2,43.43 114.94,44.7 R7.1 | J_MAG1.9 85.72,42.67 87,43.94 87,47.5 88.27,47.5 J_MAG1.6 | 92.08,13.97 92.08,11.68 R3.1 | 88.27,14.48 91.31,14.48 91.82,13.97 R2.2 92.08,13.97 | 88.27,14.48 87,14.48 87,10.92 85.72,9.65 J_MAG2.9 | 88.27,14.48 J_MAG2.6 | 92.08,13.97 93.85,15.75 121.31,15.75 U$3.14 | R8.2 118.49,50.8 v118.54,50.85
  Bottom 0.254: v129.16,44.7 131.7,47.24 131.7,49.02 IC3.3 131.7,49.28 | MOT_ENC.1 165.74,43.18 165.74,52.96 158.72,59.97 134.59,59.97 126.01,51.38 126.26,51.38 | S1.1 88.52,28.45 89.53,27.43 89.53,16 88.27,14.73 J_MAG2.6 | J_MAG1.9 85.72,42.42 85.47,42.16 85.47,29.72 84.96,29.21 84.96,27.94 85.47,27.43 88.27,27.43 88.27,28.45 S1.1 | S1.1 88.52,28.7
  Bottom 0.406: 88.52,28.7 93.09,33.27 93.09,39.47 94.77,41.15 109.35,41.15 114.68,46.48 114.68,46.99 v118.54,50.85 120.04,51.38 126.01,51.38 | 126.26,51.38 129.54,49.07 IC3.3
A0  (via drill 0.61)
  Top 0.203: IC1.17 126.31,28.14 v126.11,27.94
  Top 0.254: v111.63,21.08 112.14,20.57 125.86,20.57 v126.11,20.83
  Bottom 0.254: v126.11,20.83 v126.11,27.94 | v111.63,21.08 111.63,23.67 U$8.5
A4  (via drill 0.61)
  Top 0.203: IC1.60 147.1,28.54 v149.22,26.42
  Top 0.254: v155.83,33.02 163.19,33.02 GYRO/ACC.5
  Bottom 0.254: v149.22,26.42 v155.83,33.02
A9  (via drill 0.61)
  Top 0.203: IC1.28 135.37,19.8 134.64,19.07
  Top 0.254: 134.64,19.07 131.47,19.07 v130.18,17.78 | U$3.5 126.69,10.92 v127,11.56
  Bottom 0.254: v130.18,17.78 130.18,14.73 v127,11.56
B0  (via drill 0.61)
  Top 0.203: IC1.25 129.77,24.94 129.24,24.41
  Top 0.254: 129.24,24.41 129.16,24.38 122.38,24.41 120.87,25.87 C11.1 120.2,25.91 118.75,25.91 v118.24,26.42
  Bottom 0.254: v118.24,26.42 118.24,30.73 R19.1
B1  (via drill 0.6)
  Top 0.203: 128.8,25.35 IC1.24
  Top 0.254: C19.1 96.9,53.34 99.44,50.8 99.95,50.8 R21.1 | 122.38,37.36 v122.4,37.34 122.25,37.49 121.06,37.49 117.58,40.97 109.65,40.97 108.69,42.14 v106.48,42.14 | 128.8,25.35 128.68,25.22 123.09,25.22 122.56,25.76 v122.43,25.76
  Bottom 0.254: R21.1 100.97,50.7 102.01,49.66 102.01,44.53 103.78,42.75 105.87,42.75 v106.48,42.14 | v122.4,37.34 122.4,25.78 v122.43,25.76
B3  (via drill 0.61)
  Top 0.203: IC1.22 123.34,26.14 123.32,26.16
  Top 0.254: 123.32,26.16 122.05,27.43 v116.97,27.43 116.97,25.56 C4.1
  Bottom 0.254: v116.97,27.43 116.97,33.53 117.98,34.54 R18.1
B5  (via drill 0.6)
  Top 0.203: IC1.20 133.78,26.94 v134.29,27.46
  Top 0.254: 121.13,50.83 C18.1 | v120.34,50.04 121.13,50.83 | 121.13,50.83 121.13,52.96 R20.1
  Bottom 0.254: v120.34,50.04 120.5,50.04 125.37,45.16 125.37,41.38 129.97,36.78 132.28,36.78 134.47,34.59 134.29,34.42 v134.29,27.46
B9  (via drill 0.61)
  Top 0.203: IC1.33 137.37,24.75 137.62,24.99
  Top 0.254: C23.1 148.46,41.66 150.24,39.88 R25.1 | v143.51,32.49 139.45,28.42 139.45,26.82 137.62,24.99
  Bottom 0.254: R25.1 150.75,39.88 150.75,39.73 v143.51,32.49
B12  (via drill 0.61)
  Top 0.203: IC1.41 140.57,20.09 141.1,19.56
  Top 0.254: C20.1 158.88,24.64 157.1,26.42 R22.1 | 141.1,19.56 142.37,18.29 143.38,18.29 v144.4,17.27
  Bottom 0.254: R22.1 157.1,26.42 157.1,25.4 154.71,23.01 151.97,23.01 146.23,17.27 v144.4,17.27
B13  (via drill 0.61)
  Top 0.203: IC1.42 140.97,21.13 143.08,19.02 143.87,19.02 143.89,19.05
  Top 0.254: 150.24,17.02 149.22,18.03 144.91,18.03 143.89,19.05 | v151.51,17.53 151,17.02 150.24,17.02 | 150.24,17.02 C22.1
  Bottom 0.254: v151.51,17.53 151.51,19.05 153.8,21.34 R24.1
B14  (via drill 0.6)
  Top 0.203: 153.78,24.23 C21.1 | IC1.43 141.37,25.16 142.32,26.11
  Top 0.254: C21.1 154.05,24.38 154.05,26.42 R23.1 | 142.32,26.11 143.23,26.11 145.67,23.67 v146.69,23.67 | v150.44,24.23 153.78,24.23
  Bottom 0.254: v146.69,23.67 149.88,23.67 v150.44,24.23
B15  (via drill 0.6, 0.61)
  Top 0.203: IC1.44 141.77,21.37 143.2,19.94 144.55,19.94 145.19,19.3
  Top 0.254: R16.1 136.02,12.19 140.33,12.19 C2.1 140.59,12.45 141.61,13.46 v144.4,13.46 | v149.83,18.9 145.59,18.9 145.19,19.3
  Bottom 0.254: v144.4,13.46 v149.83,18.9
C1  (via drill 0.61)
  Top 0.203: IC1.6 128.59,32.54 125.58,35.56
  Top 0.254: v113.66,33.53 119.05,33.53 121.08,35.56 125.58,35.56
  Bottom 0.254: GATES.1 113.66,26.67 v113.66,33.53
C12
  Top 0.203: IC1.63 148.69,29.74 149.25,29.18 150.59,29.18 Y1.1
C13
  Top 0.203: IC1.73 147.66,33.74 149.48,35.56
  Top 0.254: 149.48,35.56 163.19,35.56 GYRO/ACC.7
C15
  Top 0.203: IC1.64 148.2,30.14 149.43,31.37 150.44,31.37 Y1.3
D3  (via drill 0.61)
  Top 0.203: v135.31,31.6 137.24,33.53 141.71,33.53 143.37,35.19 IC1.78
  Top 0.254: U$3.1 121.61,12.06 v121.72,12.17
  Bottom 0.254: v121.72,12.17 135.25,25.65 v135.31,31.6
E2  (via drill 0.61)
  Top 0.152: U$8.3 102.23,27.94
  Top 0.203: IC1.98 135.37,37.33 134.72,37.97 131.98,37.97
  Top 0.254: v131.14,35.33 131.14,37.13 131.98,37.97 | U$8.3 101.24,28.98 99.42,28.98 98.68,28.25 98.68,24.43 103.25,19.86 128.09,19.86 v128.14,19.81
  Bottom 0.254: v128.14,19.81 131.19,22.86 131.19,35.28 v131.14,35.33
E7  (via drill 0.61)
  Top 0.203: IC1.5 129.03,32.94 129.03,32.97 125.65,36.35 118.01,36.35 v116.46,34.8
  Bottom 0.254: GATES.2 116.46,29.46 v116.46,34.8
G6  (via drill 0.61)
  Top 0.203: IC1.10 130.17,30.94 129.36,31.75 126.62,31.75 125.86,32.51
  Top 0.254: v84.45,35.81 87.76,32.51 125.86,32.51
  Bottom 0.254: v84.45,35.81 84.45,36.58 83.19,37.85 S3.P$2
GND  (via drill 0.6, 0.61)  (1 unrouted)
  Top 0.152: C4.2 117.22,23.62
  Top 0.203: IC1.15 136.94,28.94 v138.63,30.63 | IC1.75 147.01,34.54 v147.5,35.03 | v147.73,31.17 147.73,30.81 147.46,30.54 IC1.65 143.73,30.54 v143.69,30.5 | IC1.31 136.57,21.24 v137.52,20.3 138.57,21.35 IC1.36 | 145.67,20.32 145.19,20.8 143.23,20.8 142.17,21.86 IC1.45
  Top 0.254: 132.21,58.4 131.19,59.69 C10.2 130.94,59.69 | 133.73,58.37 134.75,59.69 C9.2 | 137.54,58.37 138.56,59.69 C8.2 | 139.32,58.4 141.35,58.67 142.37,59.69 C7.2 | 120.02,47.75 122.05,49.78 123.32,49.78 124.33,50.8 C18.2 124.59,51.05 124.59,51.54 v125.63,52.58 126.4,51.8 R4.1 | 120.02,47.75 119,46.74 C5.2 | 120.02,47.75 106.55,47.75 106.55,45.47 MAGNET1.3 106.3,45.47 106.3,43.18 104.78,41.66 97.41,41.66 95.38,39.62 C12.1 95.38,39.37 95.38,37.39 U$8.10 99.06,37.31 105.61,37.31 U$8.6 | U$7.4 147.95,7.87 v147.7,7.87 | 156.08,23.62 155.57,24.13 C21.2 | 156.08,23.62 159.89,23.62 160.66,24.38 C20.2 160.91,24.64 161.67,25.4 165.23,25.4 | 156.08,23.62 156.08,20.32 145.67,20.32 | 154.15,30.48 163.19,30.48 GYRO/ACC.3 165.74,29.21 165.74,25.91 165.23,25.4 | 154.15,30.48 150.75,30.48 Y1.2 | 142.11,43.43 142.62,43.43 C1.2 142.88,43.18 144.91,43.18 | 142.11,43.43 140.59,43.43 C6.1 | 142.11,43.43 142.11,46.48 C17.1 141.08,45.8 v140.23,45.8 | 144.91,43.18 146.43,41.66 C23.2 | 151.76,43.18 144.91,43.18 | 151.76,43.18 MOTOR.3 | 151.76,43.18 152.53,42.42 162.43,42.42 MOT_ENC.2 | 165.23,25.4 165.74,25.4 165.74,16.99 165.3,16.56 160.91,16.56 159.31,14.96 | 116.2,5.08 JP4.5 | C13.1 90.8,41.66 90.04,42.42 88.27,42.42 J_MAG1.10 | 90.04,7.62 91.06,7.62 C14.1 91.31,7.87 92.08,8.64 100.97,8.64 MAGNET2.3 100.97,6.35 102.23,5.08 116.2,5.08 | 90.04,7.62 89.53,7.62 89.53,5.33 C15.1 | 90.04,7.62 88.27,9.4 J_MAG2.10 | v141.86,12.19 140.59,10.92 C2.2 140.33,10.67 138.3,8.64 129.08,8.64 | XBEE.10 98.68,18.03 95.63,21.08 87.76,21.08 87,20.32 87,17.27 85.72,17.27 J_MAG2.3 | C11.2 120.18,24.05 118.97,24.05 118.47,23.55 117.27,23.55 C4.2 116.88,23.16 104.52,23.16 U$8.2
  Top 0.254: 147.73,30.81 147.73,31.06 149.48,32.82 151.82,32.82 154.15,30.48 | PICKIT.3 138.99,15.49 149.99,15.49 150.24,15.24 C22.2 152.78,15.15 C3.2 158.81,15.46 159.31,14.96 | J_MAG1.3 85.72,50.29 87,50.29 87,53.34 87.76,54.1 94.36,54.1 95.12,53.34 C19.2 94.96,53.11 v93.27,53.11 | 112.65,56.64 GYRO1.9 | GYRO1.2 95.12,56.64 | 129.08,8.64 119.76,8.64 116.2,5.08 | U$3.7 129.24,8.79 129.08,8.64 | R13.1 126.92,2.82 129.31,5.21 129.31,8.41 129.08,8.64 | 159.31,14.96 159.31,13.89 U$6.5 | 73.51,47.52 Q1.3 | 73.97,39.62 73.63,39.29 73.04,39.29 Q2.3
  Top 0.406: 132.21,58.4 133.73,58.37 137.54,58.37 139.32,58.4 140.33,57.66 140.36,57.63 140.36,54.46 141.47,53.35 C16.1 140.22,50.57 v139.22,50.57 | 112.65,56.64 111.38,58.34 96.39,58.34 95.12,56.64 | 75,27.86 74.99,17.86 74.99,8.97 JP8.5 | 75,27.86 75.01,38.48 73.97,39.62 74.78,40.44 74.78,46.25 73.51,47.52 | M_POWER.1 73.14,29.72 75,27.86
  Top 0.61: U$2.2 42.47,18.39 62.19,18.39 J1.P$4 J1.GND 70.56,17.07 67.87,14.38 67.87,2.21 JP8.5
  Bottom 0.152: 85.98,16.76 J_MAG2.3 | JP8.5 68.17,1.88
  Bottom 0.203: v138.63,30.63 143.56,30.63 v143.69,30.5 | v147.5,35.03 147.5,31.39 v147.73,31.17
  Bottom 0.254: XBEE.10 98.93,18.03 99.69,18.8 99.69,27.79 U$8.2 | 136.53,49.28 IC3.1 | 142.62,12.95 140.08,15.49 137.79,15.49 137.79,16.69 PICKIT.3 137.52,16.97 v137.52,20.3 | 142.62,12.95 v147.7,7.87 | 163.19,38.86 162.18,37.85 J_LED1.1 | 163.19,38.86 163.19,43.18 MOT_ENC.2 | GYRO/ACC.3 163.19,30.48 163.19,38.86 | S3.P$1 88.01,37.85 88.27,38.1 J_MAG1.10 88.27,42.67 87,43.94 87,48.77 85.98,49.78 | 85.98,49.78 85.72,50.04 J_MAG1.3 85.98,49.78 | 83.19,32.77 82.42,32 82.42,20.57 85.72,17.27 J_MAG2.3 85.72,17.02 85.98,16.76 87,15.75 87,10.92 88.27,9.65 J_MAG2.10 | 85.98,49.78 81.15,44.96 81.15,34.8 83.19,32.77 | 83.19,32.77 S2.P$2 | v141.86,12.19 142.62,12.95 | GYRO1.2 94.87,56.64 94.87,54.71 v93.27,53.11 | GYRO1.9 112.9,56.64 | v139.22,50.57 139.22,46.81 v140.23,45.8
  Bottom 0.406: v139.22,50.57 136.53,49.28 | 94.87,56.64 92.08,59.44 JP2.4 | 112.9,56.64 112.9,55.85 114.02,54.74 123.47,54.74 v125.63,52.58 | 43.92,39.75 43.92,24.11 U$2.2 | 43.92,39.75 JP9.4 | U$2.4 42.82,40.84 43.92,39.75
HEAT  (via drill 0.6)
  other vias: 63.73,55.19 66.95,54.66 65.1,51.69 68.07,51.69 63.12,51.69 63.12,49.76 65.18,49.63 67.79,49.63 62.66,41.48 63.86,33.17 64.13,41.25
  pour Top (isolate 0.254): 61.34,57.05 69.72,57.05 73.02,56.52 73.08,32.56 68.17,30.78 63.68,30.86 61.62,32.92 61.62,56.52 61.14,57
  pour Bottom (isolate 0.254): 61.39,57.25 69.77,57.25 73.02,56.85 73.08,32.59 69.11,30.86 62.51,30.86 62.23,31.14 62.23,31.8 61.19,32.84 61.19,56.92 61.06,57.05 61.26,57.05
HEAT1  (via drill 0.6)
  other vias: 138.35,56.72 138.35,55.32 132.69,52.68 129.26,52.73 129.26,51.51 136.17,52.68 138.35,52.73 138.35,54
  pour Bottom (isolate 0.254): 126.9,51.79 134.59,59.49 140.49,59.49 141.38,58.6 141.38,52.83 140.03,52.83 137.29,50.09 131.22,50.09 130.68,49.56 129.08,49.56 127.08,51.56
  pour Top (isolate 0.254): 126.29,52.35 126.42,52.35 132.31,58.24 139.19,58.24 140.28,57.15 140.28,54.18 140.77,53.7 140.92,53.7 141.68,52.93 141.68,52.12 141.25,51.69 141.07,51.69 139.14,49.76 139.14,47.83 138.71,47.4 138.56,47.4 138.23,47.07 127.74,47.07 126.9,47.9 126.9,51.79 126.52,52.17
LED0/G12
  Top 0.203: IC1.96 136.17,38.71 134.98,39.9 133.79,39.9 R5.2
LED1/G13
  Top 0.203: IC1.97 135.77,37.74 134.67,38.84 131.28,38.84 R6.2
MCLR  (via drill 0.61)
  Top 0.203: IC1.13 125.32,29.74 v124.84,30.23
  Top 0.254: PICKIT.5 132.46,16.76 129.92,16.76 127.38,19.3 124.08,19.3 v124.08,18.8 123.8,19.07 99.16,19.07 v88.27,29.97 93.23,29.97 R1.2
  Bottom 0.254: v88.27,29.97 88.27,32.77 S2.P$1 | v124.84,30.23 124.08,29.46 v124.08,18.8
N$1  (via drill 3.28 pad 5.08)
  other vias: 163.83,3.17
N$2
  Top 0.254: 100.71,42.42 102.23,42.42 R11.2 | 98.45,42.42 96.39,42.42 95.38,41.4 C12.2 | 98.45,42.42 100.71,42.42 | 100.71,42.42 103.76,45.47 MAGNET1.1 | Y2.2 99.11,43.08 98.45,42.42
N$3
  Top 0.203: IC1.85 140.57,38.37 140.33,38.61
  Top 0.254: C1.1 142.62,41.66 140.59,41.66 C6.2 140.33,41.4 140.33,38.61
N$4  (via drill 0.6)
  Top 0.254: R4.2 126.44,48.21 v126.03,47.8
  Bottom 0.254: POWER.C 126.49,43.69 126.49,47.35 v126.03,47.8
N$5  (via drill 0.61)
  Top 0.254: v136.78,41.4 133.99,41.4 R5.1
  Bottom 0.254: v136.78,41.4 136.78,42.67 135.76,43.69 LED2.C
N$6  (via drill 0.61)
  Top 0.254: 93.85,13.97 95.12,15.24 99.69,15.24 100.97,13.97 MAGNET2.12 | v94.87,12.95 93.85,13.97 | 93.85,13.97 R2.1
  Bottom 0.254: v94.87,12.95 94.87,8.13 87.76,8.13 87,8.89 87,10.16 86.49,10.67 86.49,11.18 85.72,11.94 J_MAG2.7
N$7  (via drill 0.61)
  Top 0.254: v133.22,44.2 138.05,44.2 138.81,43.43 138.81,42.16 137.29,42.16 136.78,42.67 131.44,42.67 130.43,41.66 R6.1
  Bottom 0.254: v133.22,44.2 133.22,43.94 132.21,43.94 LED3.C
N$8  (via drill 0.61)
  Top 0.254: 107.31,50.04 113.16,50.04 113.92,50.8 R8.1 | 107.31,50.04 106.55,50.8 106.55,51.56 MAGNET1.12 | v91.57,40.39 84.45,40.39 84.45,43.69 85.72,44.96 J_MAG1.7 | v100.46,49.28 101.22,50.04 107.31,50.04
  Bottom 0.254: v91.57,40.39 v100.46,49.28
N$9
  Bottom 0.254: GYRO1.4 100.2,56.64 102.49,54.36 102.49,45.72 112.9,45.72 113.66,46.48 113.66,53.11 R20.2
N$10
  Top 0.254: J_MAG2.8 88.27,11.94 89.53,10.67 92.58,10.67 93.6,11.68 R3.2 102.23,11.68 MAGNET2.11
N$11  (via drill 0.61)
  Top 0.254: v112.65,46.74 114.94,46.74 R7.2 | v107.82,53.34 107.82,51.82 MAGNET1.11 | v104.52,48.26 91.31,48.26 88.27,45.21 J_MAG1.8
  Bottom 0.254: 107.82,51.56 v112.65,46.74 | 107.82,51.56 v107.82,53.34 | v104.52,48.26 107.82,51.56
N$12
  Top 0.254: MAGNET1.10 108.84,51.82 108.84,55.12 86.23,55.12 84.45,53.34 84.45,47.75 85.72,47.75 J_MAG1.5
N$13  (via drill 0.61)
  Top 0.254: v107.06,14.73 103.5,14.73 MAGNET2.10
  Bottom 0.254: v107.06,14.73 100.46,8.13 95.38,8.13 95.38,7.87 95.12,7.62 84.45,7.62 84.45,13.21 85.72,14.48 J_MAG2.5
N$14  (via drill 0.61)
  Top 0.254: v159.13,27.18 159.64,26.67 GYRO/ACC.2
  Bottom 0.254: v159.13,27.18 159.13,32.26 157.35,34.04 R22.2
N$15
  Top 0.254: 105.03,45.47 105.03,44.7 104.27,43.94 104.27,42.67 R11.1 | C13.2 92.84,41.66 92.84,44.53 Y2.1 94.03,46.41 94.87,47.24 105.03,47.24 105.03,45.47 | 105.03,45.47 MAGNET1.2
N$16  (via drill 0.61)
  Top 0.254: C14.2 92.84,7.62 95.12,7.62 95.38,7.37 R9.2 95.63,7.11 v97.16,7.11 98.42,7.11 MAGNET2.1
  Bottom 0.254: v97.16,7.11 97.16,4.32 103.5,4.32 106.55,7.37 110.87,7.37 Y3.2
N$17  (via drill 0.61)
  Top 0.254: C15.2 91.31,5.33 95.38,5.33 R9.1 95.63,5.59 99.69,5.59 | 99.69,5.59 MAGNET2.2 | 99.69,5.59 v99.95,5.33
  Bottom 0.254: v99.95,5.33 103.76,5.33 110.87,12.45 Y3.1
N$18  (via drill 0.61)
  Top 0.254: 145.41,51.82 R10.2 145.25,51.82 C16.2 143.33,51.98 143.33,53.24 142.26,54.3 Y4.2 | v147.95,45.72 148.72,45.72 149.22,45.21 MOTOR.1
  Bottom 0.254: v147.95,45.72 147.95,48.77 143.87,52.86 143.87,54.23 Y4.2
N$19  (via drill 0.61)
  Top 0.254: 148.97,46.74 149.73,46.74 150.5,45.97 MOTOR.2 | 148.97,46.74 143.89,46.74 C17.2 | v148.97,49.53 145.67,49.53 145.41,49.78 R10.1 | 148.97,46.74 v148.97,47.42
  Bottom 0.254: v148.97,47.42 v148.97,49.53 147.34,51.16 Y4.1
N$20
  Top 0.254: MOT_ENC.3 162.69,48.77 151.76,48.77 MOTOR.12
N$21
  Top 0.254: MOT_ENC.4 153.03,49.53 MOTOR.11
N$22
  Top 0.254: MOT_ENC.5 163.7,52.83 154.31,52.83 MOTOR.10
N$23
  Top 0.254: R15.2 149.5,6.17 151.89,8.56 153.16,8.56 154.56,9.96 155.8,9.96 157.94,12.09 157.94,13.79 U$6.6
N$24
  Top 0.254: U$7.3 146.69,9.91 152.78,9.91 153.82,10.95 155.02,10.95 156.69,12.62 U$6.7
N$25
  Top 0.254: 145.41,3.81 145.41,3.05 R14.2 | 145.41,3.81 U$7.2 | 145.41,3.81 135.25,3.81 134.49,3.05 R13.2
  Bottom 0.254: R13.2 134.24,3.05 131.7,5.59 131.7,6.86 R12.1
N$26  (via drill 0.61)
  Top 0.254: v137.29,9.65 136.53,9.65 136.02,10.16 R16.2 | U$7.6 146.69,10.41 142.62,10.41 139.32,7.11 R12.2
  Bottom 0.254: v137.29,9.65 139.06,7.87 139.06,7.11 R12.2
N$27
  Top 0.254: U$3.2 U$3.3
N$28  (via drill 0.61)
  Top 0.254: v139.06,13.21 127.03,13.21 125.45,11.63 125.45,9.88 U$3.4
  Bottom 0.254: R17.2 160.71,18.85 148.36,6.5 145.77,6.5 v139.06,13.21
N$29
  Top 0.254: U$6.1 U$6.2 156.69,9.35 158.09,10.74 162.51,10.74 H-BRIDGE.2
N$30
  Top 0.254: U$6.3 U$6.4 159.13,8.64 162.94,8.64 H-BRIDGE.1
N$31  (via drill 0.61)
  Top 0.254: U$3.6 127.97,10.49 128.42,10.95 130.2,10.95 130.58,10.57 130.58,9.8 v130.43,9.65
  Bottom 0.254: H-BRIDGE.3 159.64,15.24 153.01,8.61 151.99,8.61 | 151.99,8.61 151.89,8.61 | v130.43,9.65 130.99,9.65 133.78,6.86 133.78,5.38 136.27,2.9 136.27,1.83 136.93,1.17 146.28,1.17 149.86,4.75 149.86,6.48 151.99,8.61
N$32  (via drill 0.6)
  Top 0.254: Q1.1 72.47,42.93 72.47,42.92 v73.43,41.38
  Bottom 0.254: GATES1.2 66.73,29.87 73.41,36.4 73.46,40.66 v73.43,41.38
N$33
  Top 0.254: GATES1.1 68.43,25.3 69.37,26.31 69.32,31.66 Q2.1
N$34
  Bottom 0.254: R21.2 92.58,50.8 97.41,55.63 97.41,56.64 GYRO1.3
N$35
  Bottom 0.254: U$8.8 106.81,30.99 110.36,30.99 R19.2
N$36
  Top 0.254: U$8.9 100.71,34.54 110.36,34.54 R18.2
N$37  (via drill 3.28 pad 5.08)
  other vias: 78.74,3.17
N$38
  Bottom 0.254: GYRO/ACC.4 163.19,27.94 163.19,20.57 160.91,20.57 160.15,21.34 160.15,36.07 156.08,36.07 154.31,34.29 R23.2
N$39  (via drill 3.28 pad 5.08)
  other vias: 78.74,59.05
N$40  (via drill 3.28 pad 5.08)
  other vias: 163.83,59.05
N$41  (via drill 3.28 pad 5.08)
  other vias: 121.28,59.05
N$42  (via drill 3.28 pad 5.08)
  other vias: 121.28,3.17
N$43
  Bottom 0.254: GYRO/ACC.6 160.66,30.48 160.66,22.35 161.42,21.59 R24.2
N$44
  Bottom 0.254: GYRO/ACC.8 160.66,35.56 160.66,37.85 158.62,39.88 R25.2
N$45
  Top 0.254: Q1.4 64.55,45.06 63.47,44.81 | D2.A 58.14,44.81 | 58.9,50.39 MAGNETS.2
  Top 0.406: 58.9,50.39 60.17,49.12 60.17,44.81 58.14,44.81
  Top 0.61: 58.14,44.81 64.55,44.81 64.55,45.06
N$46
  Top 0.61: D1.A 65.54,35.79 Q2.4
  Bottom 0.254: 58.9,55.47 MAGNETS.4 | D1.A 60.68,35.92
  Bottom 0.406: 58.9,55.47 60.68,53.7 60.68,35.92
N$47
  Top 0.254: GYRO2.8 16.33,51.69 19.15,48.56 19.15,20.14 17.22,18.29 12.34,18.29 12.19,18.44 | GYRO/ACC1.1 10.31,16.56 12.19,18.44 | 12.19,18.44 U$1.4
  Bottom 0.254: GYRO/ACC1.1 9.14,16.15 | 9.14,16.15 8.18,15.19 8.18,13.99 J_LED2.1 | 9.14,16.15 9.14,17.37 U$1.1
N$48
  Top 0.152: 7.07,32.37 7.09,32.36
  Top 0.254: GYRO/ACC1.3 5.87,13.61 J_LED2.2 5.56,16.92 | GYRO2.9 2.74,51.38 2.74,38.1 4.39,36.45 GYRO2.2 7.21,34.82 7.21,32.51 7.07,32.37 6.33,31.62 U$1.10 6.3,27.81 4.11,25.63 4.11,18.36 5.56,16.92 | 7.09,32.36 14.71,32.36 16.48,30.58 U$1.6 | 5.56,16.92 5.59,16.92 U$1.2
N$49  (via drill 0.6)
  Top 0.254: GYRO/ACC1.8 15.9,8.53 v18.36,11
  Bottom 0.254: v18.36,11 18.36,35.43 14.91,38.89 5.69,38.89 GYRO2.3
N$50  (via drill 0.6)
  Top 0.254: GYRO/ACC1.6 14.5,11.07 14.5,11.15 v19.86,16.51
  Bottom 0.254: GYRO2.4 5.77,41.35 16.46,41.35 19.86,37.95 v19.86,16.51
N$51
  Bottom 0.254: GYRO/ACC1.7 10.39,8.74 11.56,9.96 11.56,20.04 U$1.3
N$52
  Top 0.254: GYRO/ACC1.4 12.67,13.82 11.66,14.83 8.97,14.83 7.64,16.15 7.64,16.99 9.88,19.23 9.88,26.8 U$1.9
N$53
  Bottom 0.152: U$1.5 16.48,20.17
  Bottom 0.254: 16.48,20.17 15.98,19.66 15.98,9.75 13.44,6.83 13.31,6.71 9.27,6.71 8.36,7.62 8.36,9.93 9.45,11.02 10.13,11.02 GYRO/ACC1.5
N$54
  Bottom 0.254: GYRO/ACC1.2 12.67,16.43 12.67,26.54 U$1.8
N$55  (via drill 2.8)
  other vias: 25.5,50.65
N$56  (via drill 2.8)
  other vias: 25.5,10.01
N$57  (via drill 2.8)
  other vias: 153.03,57.15
N$58  (via drill 2.8)
  other vias: 125.86,56.52
N$59  (via drill 2.8)
  other vias: 153.03,5.71
N$60  (via drill 2.8)
  other vias: 125.86,5.71
N$61
  Top 0.406: 125.81,52.48 126.31,52.48 132.23,58.4
N$115
  Top 0.254: H-BRIDGE.4 163.5,17.3 155.04,17.3 R17.1 153.09,18.03 C3.1
PGC/B6  (via drill 0.61)
  Top 0.203: IC1.26 134.57,24 134.98,24.41 134.98,25.25 135.84,26.11 137.49,26.11 v137.79,26.42
  Bottom 0.254: 142.62,17.02 PICKIT.1 142.62,16.94 142.62,19.07 139.93,21.77 139.93,25.48 138.99,26.42 v137.79,26.42
PGD/B7  (via drill 0.61)
  Top 0.203: IC1.27 134.97,21.25 v133.73,20.02
  Top 0.254: v133.99,18.03 134.24,18.29 138.81,18.29 140.08,17.02 PICKIT.2
  Bottom 0.254: v133.73,20.02 133.73,18.29 v133.99,18.03
RXT  (via drill 0.6)
  Top 0.203: IC1.12 132.65,30.12 128.8,30.12 v128.4,30.53
  Top 0.254: v113.13,22.2 118.01,22.23 118.57,22.78 127.89,22.78 v128.42,23.32
  Bottom 0.254: v128.42,23.32 128.42,30.2 v128.4,30.53 | 112.98,17.98 XBEE.3 113.13,18.14 v113.13,22.2
SCK1  (via drill 0.6, 0.61)
  Top 0.203: IC1.70 147.73,32.54 v149.22,34.04
  Top 0.254: v111.63,9.65 107.57,5.59 103.5,5.59 MAGNET2.5 | MAGNET1.5 109.09,45.47 109.09,44.12 111.1,42.11 118.54,42.11 v119.76,40.89 | v154.05,43.43 154.05,44.96 154.31,44.96 MOTOR.5 154.31,48.26 141.05,48.26 138.79,46 124.69,46 v123.57,44.88
  Bottom 0.254: v111.63,9.65 119.76,17.78 v119.76,40.89 123.57,44.7 v123.57,44.88 | v149.22,34.04 154.05,38.86 v154.05,43.43
SDI1  (via drill 0.61)
  Top 0.203: IC1.9 130.61,31.34 129.82,32.13 127.76,32.13 v127.13,32.77
  Top 0.254: v118.49,10.67 104.78,10.67 MAGNET2.6 | MAGNET1.6 110.36,45.47 110.36,43.89 110.39,43.89 111.45,42.82 121.21,42.8 121.21,42.75 v124.08,39.88 127.38,43.18 v137.79,43.18 | v155.32,46.99 155.57,46.99 MOTOR.6
  Bottom 0.254: v118.49,10.67 127.13,19.3 v127.13,32.77 127.13,36.83 v124.08,39.88 | v155.32,46.99 149.99,46.99 149.99,46.48 146.69,43.18 v137.79,43.18
SDO1  (via drill 0.61)
  Top 0.203: IC1.72 144.25,33.34 143.6,34
  Top 0.254: MOTOR.7 156.84,45.21 157.35,45.72 165.23,45.72 165.74,45.21 165.74,39.12 159.38,39.12 156.34,36.07 145.67,36.07 143.6,34 136.53,26.92 135.38,26.92 134.24,25.88 134.24,24.51 131.67,21.84 123.06,21.84 122.56,21.34 119,21.34 v118.75,21.59 | v110.36,9.65 108.59,9.65 106.05,7.11 MAGNET2.7 | MAGNET1.7 112.22,45.47 v113.97,43.64
  Bottom 0.254: v110.36,9.65 119.25,18.54 119.25,21.59 | 119.25,21.59 119.25,39.01 | 119.25,39.01 119.25,39.12 | 119.25,21.59 v118.75,21.59 | v113.97,43.64 114.55,43.64 119.25,39.01
SS1
  Top 0.203: 130.31,33.34 IC1.4
  Top 0.254: MAGNET1.4 107.82,45.47 107.82,44.27 110.59,41.5 117.91,41.5 120.55,38.86 124.82,38.86 130.31,33.37 130.31,33.34
SS2  (via drill 0.61)
  Top 0.203: IC1.19 128.18,27.34 127.79,26.95 125.32,26.95 v125.09,27.18
  Top 0.254: v119.51,12.95 117.73,11.18 102.23,11.18 MAGNET2.4
  Bottom 0.254: v119.51,12.95 125.09,18.54 v125.09,27.18
SS3  (via drill 0.61)
  Top 0.203: IC1.76 144.17,37.11 145.92,38.86
  Top 0.254: v152.78,43.43 153.03,43.43 MOTOR.4 | 145.92,38.86 v148.21,38.86
  Bottom 0.254: v148.21,38.86 v152.78,43.43
TXO  (via drill 0.61)
  Top 0.203: IC1.11 129.83,30.54 129.06,31.32 122.99,31.32
  Top 0.254: v112.65,29.97 114.68,32 122.3,32 122.99,31.32
  Bottom 0.254: v112.65,29.97 112.65,24.49 114.81,22.33 114.81,17.95 XBEE.2
V+
  Top 0.254: 60.68,25.5 D1.C 60.93,25.5 | 57.89,34.39 D2.C
  Top 0.61: 57.89,25.5 60.68,25.5 | 57.89,25.5 49.25,25.5 45.41,21.67 U$2.1 | 57.89,25.5 57.89,34.39 | 71.91,22.43 71.75,22.58 63.91,22.58 D1.C | 71.91,22.43 72.92,21.41 72.95,21.41 72.95,10.76 J1.VIN0 | M_POWER.3 71.98,22.5 71.91,22.43
  Bottom 0.254: 58.65,48.11 MAGNETS.1 58.9,47.85 59.16,47.6 | 58.65,52.93 MAGNETS.3 | D2.C 58.14,34.65
  Bottom 0.406: 58.65,48.11 56.67,49.23 56.67,51.51 58.65,52.93 | 59.16,47.6 59.16,35.66 58.14,34.65

### Text on the board
tPlace: 20 MHz | MAG1 | MAG2 | MAG2 | MAG1 | NU Monkeybot | NU Monkeybot | 20 MHz
bPlace: 20 MHz | G6 | RESET | POWER | XBEE | MCLR | 3.3V | GND | PGD | PGC